# EAGLE design byteworker (EAGLE 6.5.0)

## Sheet 1 of 3: Connector
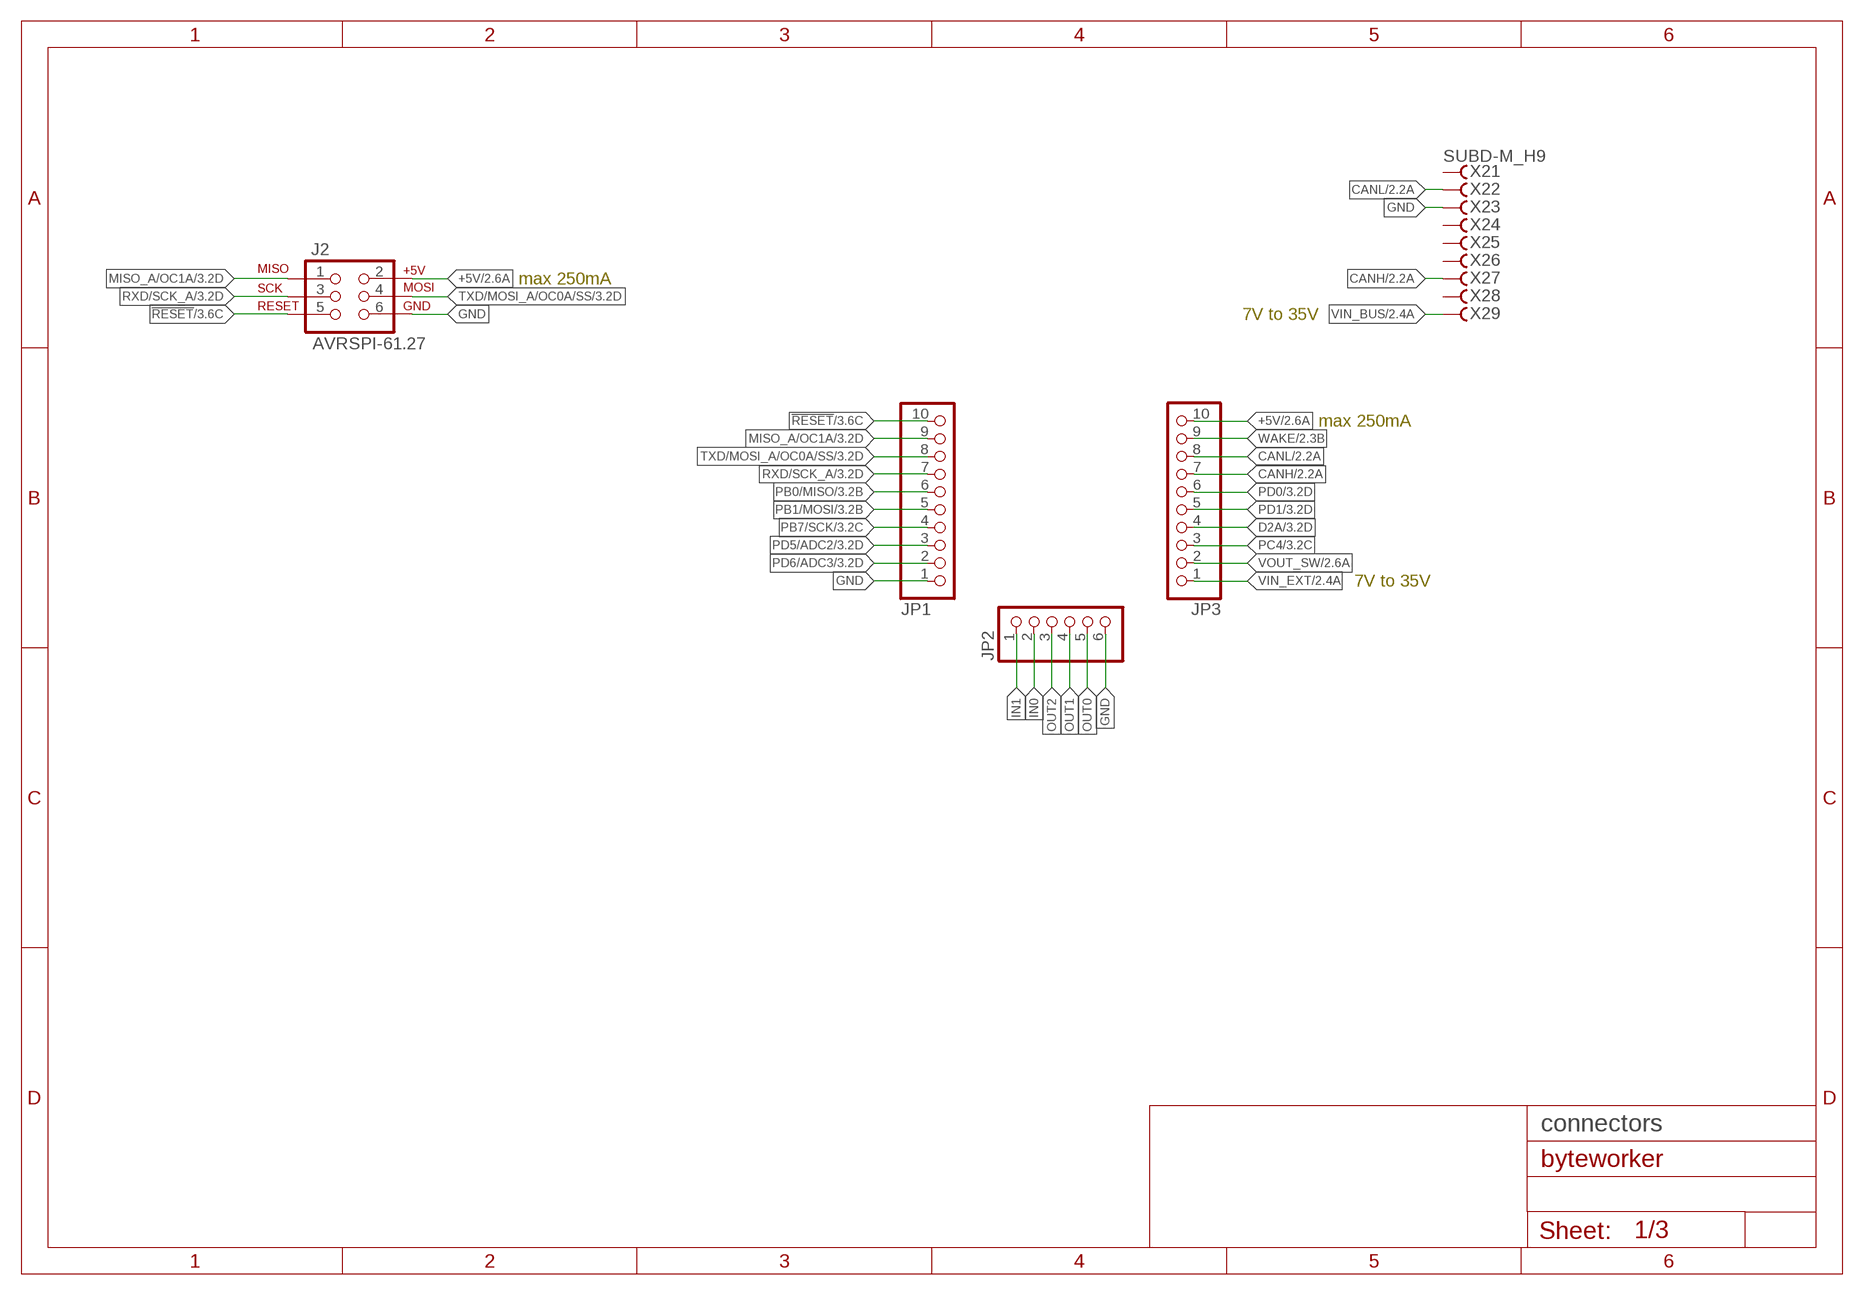
[diagram p0: schematic, sheet 1]

### Parts
J2  AVRSPI-61.27  [2X3-1.27]
JP1  PINHD-1X10  [1X10]
JP2  PINHD-1X6  [1X06]
JP3  PINHD-1X10  [1X10]
X2  SUBD-M_H9  [SUBD9]

### Nets
!RESET!: J2.5(RESET) JP1.10 ; also sheet 3
+5V: J2.2(+5V) JP3.10 ; also sheet 2,3
CANH: JP3.7 X2.8 ; also sheet 2
CANL: JP3.8 X2.4 ; also sheet 2
D2A: JP3.4 ; also sheet 3
GND: J2.6(GND) JP1.1 JP2.6 X2.3 ; also sheet 2,3
IN0: JP2.2 ; also sheet 3
IN1: JP2.1 ; also sheet 3
MISO_A/OC1A: J2.1(MISO) JP1.9 ; also sheet 3
OUT0: JP2.5 ; also sheet 3
OUT1: JP2.4 ; also sheet 3
OUT2: JP2.3 ; also sheet 3
PB0/MISO: JP1.6 ; also sheet 3
PB1/MOSI: JP1.5 ; also sheet 3
PB7/SCK: JP1.4 ; also sheet 3
PC4: JP3.3 ; also sheet 3
PD0: JP3.6 ; also sheet 3
PD1: JP3.5 ; also sheet 3
PD5/ADC2: JP1.3 ; also sheet 3
PD6/ADC3: JP1.2 ; also sheet 3
RXD/SCK_A: J2.3(SCK) JP1.7 ; also sheet 3
TXD/MOSI_A/OC0A/SS: J2.4(MOSI) JP1.8 ; also sheet 3
VIN_BUS: X2.6 ; also sheet 2
VIN_EXT: JP3.1 ; also sheet 2
VOUT_SW: JP3.2 ; also sheet 2
WAKE: JP3.9 ; also sheet 2
Unconnected: X2.1 X2.2 X2.5 X2.7 X2.9

### Notes on the sheet
- max 250mA
- 7V to 35V
- max 250mA
- 7V to 35V

## Sheet 2 of 3: Power & CAN
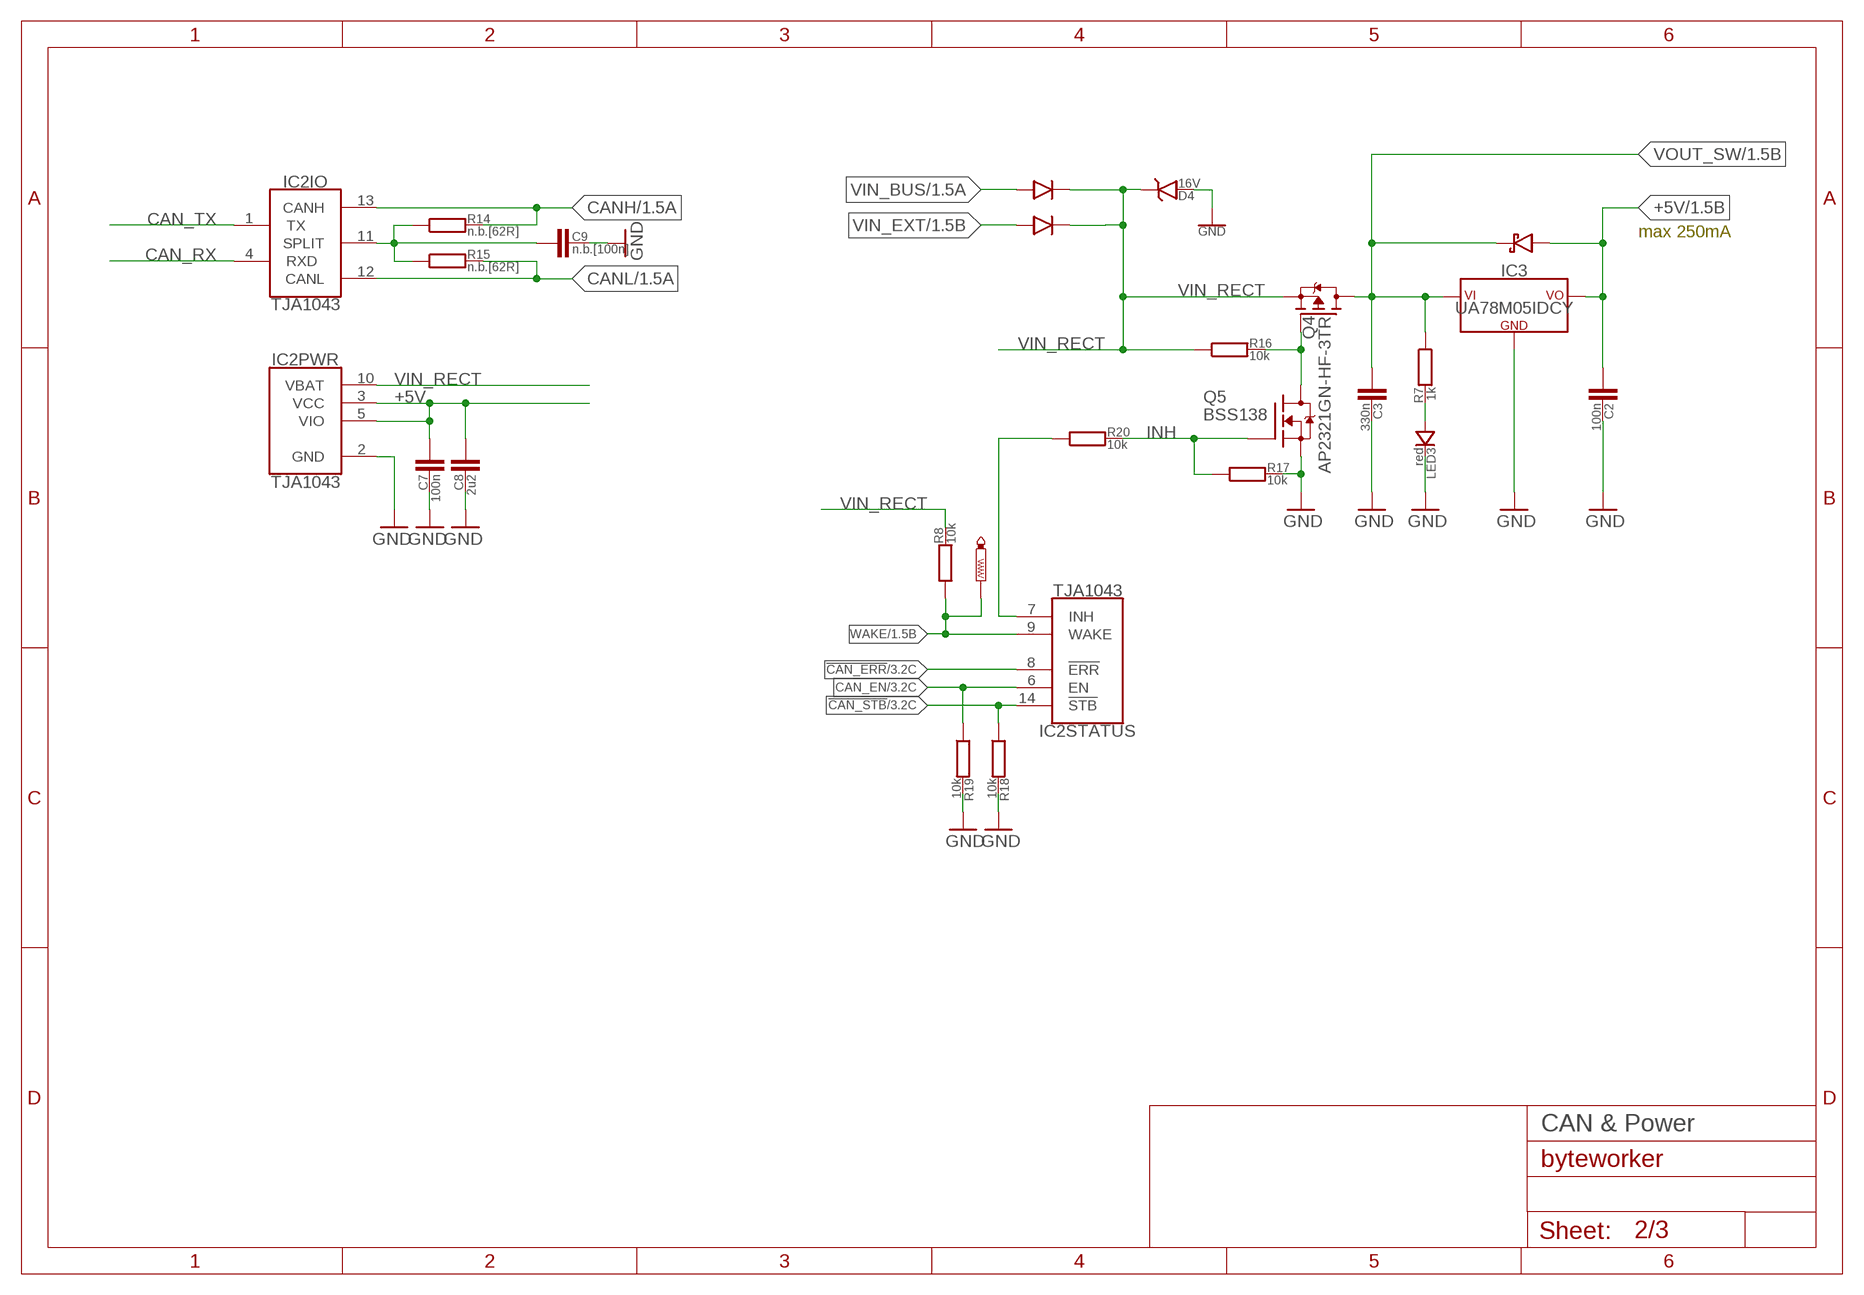
[diagram p1: schematic, sheet 2]

### Parts
C2  100n  C0603  [C0603]
C3  330n  C0603  [C0603]
C7  100n  C0603  [C0603]
C8  2u2  C0805  [C0805]
C9  n.b.[100n]  C0603  [C0603]
D1  1N5819HW  [SOD123]
D4  16V  ZENER_PTVS18VP1UP  [SOD-128]
D5  1N5819HW  [SOD123]
D6  SCHOTTKY323  [SOD323]
IC2  TJA1043  [SO14]
IC3  UA78M05IDCY  [SOT223]
LED3  red  LED0603  [LED0603]
Q4  AP2321GN-HF-3TR  [SOT23-3]
Q5  BSS138  [SOT23C]
R7  1k  R0603  [R0603]
R8  10k  R0603  [R0603]
R14  n.b.[62R]  R0603  [R0603]
R15  n.b.[62R]  R0603  [R0603]
R16  10k  R0603  [R0603]
R17  10k  R0603  [R0603]
R18  10k  R0603  [R0603]
R19  10k  R0603  [R0603]
R20  10k  R0603  [R0603]
TP2  PTR1B1,27  [B1,27]

### Nets
!CAN_ERR!: IC2.8(STATUS:!ERR!) ; also sheet 3
!CAN_STB!: IC2.14(STATUS:!STB!) R18.1 ; also sheet 3
+5V: C2.1 C7.1 C8.1 D6.A IC2.3(PWR:VCC) IC2.5(PWR:VIO) IC3.3(+5V) ; also sheet 1,3
CAN_EN: IC2.6(STATUS:EN) R19.1 ; also sheet 3
CAN_RX: IC2.4(IO:RXD) ; also sheet 3
CAN_TX: IC2.1(IO:TX) ; also sheet 3
CANH: IC2.13(IO:CANH) R14.2 ; also sheet 1
CANL: IC2.12(IO:CANL) R15.2 ; also sheet 1
GND: C2.2 C3.2 C7.2 C8.2 C9.2 D4.A IC2.2(PWR:GND) IC3.2(GND) IC3.4(GND) LED3.C Q5.2(S) R17.2 R18.2 R19.2 ; also sheet 1,3
INH: Q5.1(G) R17.1 R20.2
N$4: C9.1 IC2.11(IO:SPLIT) R14.1 R15.1
N$5: IC2.7(STATUS:INH) R20.1
N$6: Q4.1(G) Q5.3(D) R16.2
N$8: LED3.A R7.2
VIN_BUS: D5.A ; also sheet 1
VIN_EXT: D1.A ; also sheet 1
VIN_RECT: D1.C D4.C D5.C IC2.10(PWR:VBAT) Q4.2(S) R8.2 R16.1 ; also sheet 3
VOUT_SW: C3.1 D6.C IC3.1(VIN) Q4.3(D) R7.1 ; also sheet 1
WAKE: IC2.9(STATUS:WAKE) R8.1 TP2.TP ; also sheet 1

### Notes on the sheet
- max 250mA

## Sheet 3 of 3: uC
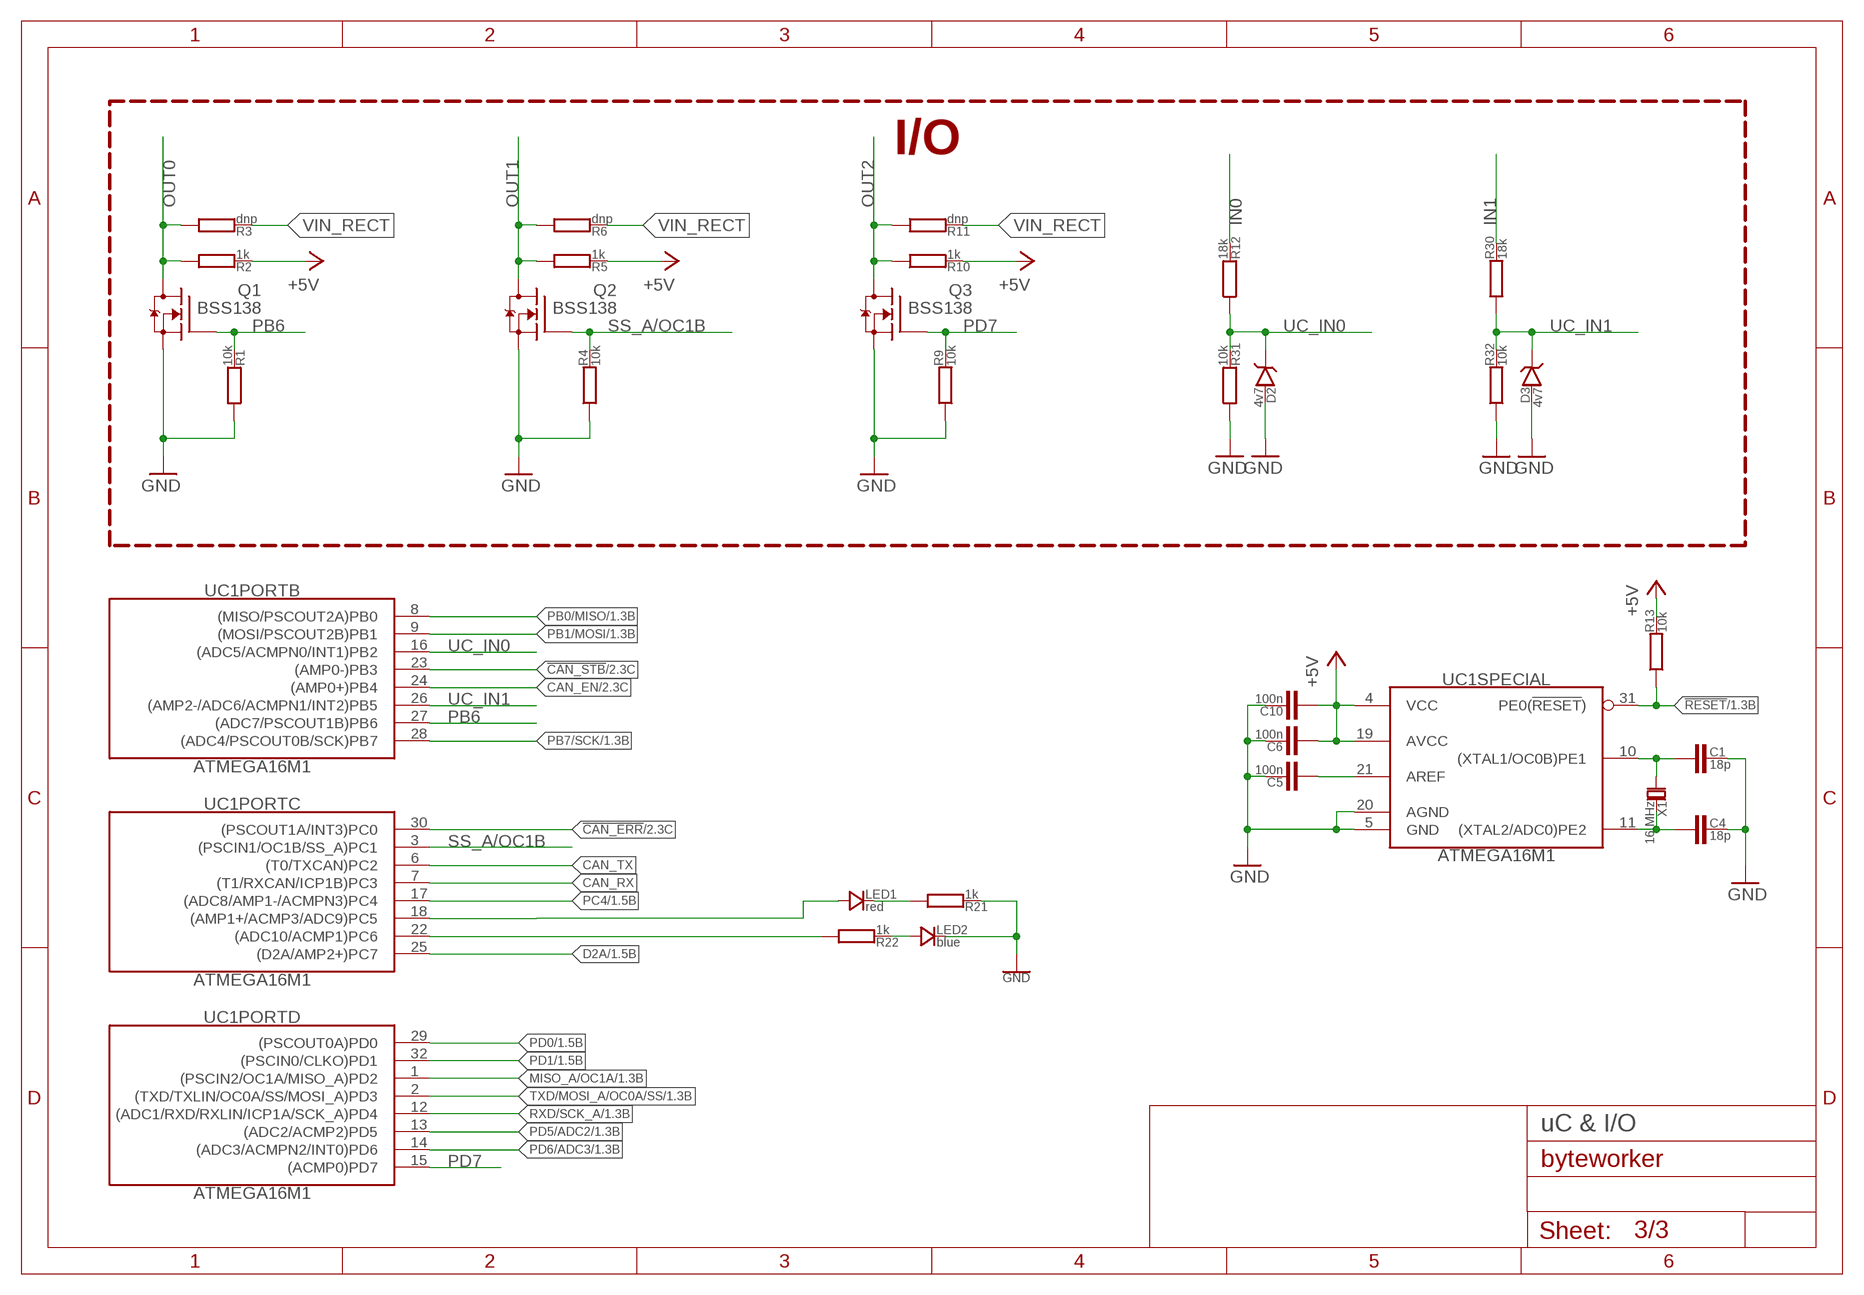
[diagram p2: schematic, sheet 3]

### Parts
C1  18p  C0603  [C0603]
C4  18p  C0603  [C0603]
C5  100n  C0603  [C0603]
C6  100n  C0603  [C0603]
C10  100n  C0603  [C0603]
D2  4v7  ZENER  [SOD80]
D3  4v7  ZENER  [SOD80]
LED1  red  LED0603  [LED0603]
LED2  blue  LED0603  [LED0603]
Q1  BSS138  [SOT23C]
Q2  BSS138  [SOT23C]
Q3  BSS138  [SOT23C]
R1  10k  R0603  [R0603]
R2  1k  R0603  [R0603]
R3  dnp  R0603  [R0603]
R4  10k  R0603  [R0603]
R5  1k  R0603  [R0603]
R6  dnp  R0603  [R0603]
R9  10k  R0603  [R0603]
R10  1k  R0603  [R0603]
R11  dnp  R0603  [R0603]
R12  18k  R0603  [R0603]
R13  10k  R0603  [R0603]
R21  1k  R0603  [R0603]
R22  1k  R0603  [R0603]
R30  18k  R0603  [R0603]
R31  10k  R0603  [R0603]
R32  10k  R0603  [R0603]
UC1  ATMEGA16M1  [TQFP32-08]
X1  16 MHz  CRYSTAL5X3.2  [5.0X3.2]

### Nets
!CAN_ERR!: UC1.30(PORTC:(PSCOUT1A/INT3)PC0) ; also sheet 2
!CAN_STB!: UC1.23(PORTB:(AMP0-)PB3) ; also sheet 2
!RESET!: R13.1 UC1.31(SPECIAL:PE0(!RESET!)) ; also sheet 1
+5V: C6.1 C10.1 R2.2 R5.2 R10.2 R13.2 UC1.4(SPECIAL:VCC) UC1.19(SPECIAL:AVCC) ; also sheet 1,2
AREF: C5.1 UC1.21(SPECIAL:AREF)
CAN_EN: UC1.24(PORTB:(AMP0+)PB4) ; also sheet 2
CAN_RX: UC1.7(PORTC:(T1/RXCAN/ICP1B)PC3) ; also sheet 2
CAN_TX: UC1.6(PORTC:(T0/TXCAN)PC2) ; also sheet 2
D2A: UC1.25(PORTC:(D2A/AMP2+)PC7) ; also sheet 1
GND: C1.2 C4.2 C5.2 C6.2 C10.2 D2.A D3.A LED2.C Q1.2(S) Q2.2(S) Q3.2(S) R1.1 R4.1 R9.1 R21.2 R31.1 R32.1 UC1.5(SPECIAL:GND) UC1.20(SPECIAL:AGND) ; also sheet 1,2
IN0: R12.2 ; also sheet 1
IN1: R30.2 ; also sheet 1
MISO_A/OC1A: UC1.1(PORTD:(PSCIN2/OC1A/MISO_A)PD2) ; also sheet 1
N$1: C1.1 UC1.10(SPECIAL:(XTAL1/OC0B)PE1) X1.1
N$2: C4.1 UC1.11(SPECIAL:(XTAL2/ADC0)PE2) X1.2
N$3: LED2.A R22.2
N$7: LED1.A UC1.18(PORTC:(AMP1+/ACMP3/ADC9)PC5)
N$9: LED1.C R21.1
OUT0: Q1.3(D) R2.1 R3.1 ; also sheet 1
OUT1: Q2.3(D) R5.1 R6.1 ; also sheet 1
OUT2: Q3.3(D) R10.1 R11.1 ; also sheet 1
PB0/MISO: UC1.8(PORTB:(MISO/PSCOUT2A)PB0) ; also sheet 1
PB1/MOSI: UC1.9(PORTB:(MOSI/PSCOUT2B)PB1) ; also sheet 1
PB6: Q1.1(G) R1.2 UC1.27(PORTB:(ADC7/PSCOUT1B)PB6)
PB7/SCK: UC1.28(PORTB:(ADC4/PSCOUT0B/SCK)PB7) ; also sheet 1
PC4: UC1.17(PORTC:(ADC8/AMP1-/ACMPN3)PC4) ; also sheet 1
PD0: UC1.29(PORTD:(PSCOUT0A)PD0) ; also sheet 1
PD1: UC1.32(PORTD:(PSCIN0/CLKO)PD1) ; also sheet 1
PD5/ADC2: UC1.13(PORTD:(ADC2/ACMP2)PD5) ; also sheet 1
PD6/ADC3: UC1.14(PORTD:(ADC3/ACMPN2/INT0)PD6) ; also sheet 1
PD7: Q3.1(G) R9.2 UC1.15(PORTD:(ACMP0)PD7)
RXD/SCK_A: UC1.12(PORTD:(ADC1/RXD/RXLIN/ICP1A/SCK_A)PD4) ; also sheet 1
SS_A/OC1B: Q2.1(G) R4.2 UC1.3(PORTC:(PSCIN1/OC1B/SS_A)PC1)
TESTLED2: R22.1 UC1.22(PORTC:(ADC10/ACMP1)PC6)
TXD/MOSI_A/OC0A/SS: UC1.2(PORTD:(TXD/TXLIN/OC0A/SS/MOSI_A)PD3) ; also sheet 1
UC_IN0: D2.C R12.1 R31.2 UC1.16(PORTB:(ADC5/ACMPN0/INT1)PB2)
UC_IN1: D3.C R30.1 R32.2 UC1.26(PORTB:(AMP2-/ADC6/ACMPN1/INT2)PB5)
VIN_RECT: R3.2 R6.2 R11.2 ; also sheet 2

### Notes on the sheet
- I/O

## Library data of the parts
C1-C10 = bytewerk-passive:C
D1 D5 = bytewerk-passive:1N5819HW: Si-Diode - Icont=1A
D2 D3 = bytewerk-passive:ZENER: zener diode
D4 = bytewerk-diode:ZENER: zener diode; MF: NXP; MPN: PTVS18VP1UP; OC_FARNELL: 1859877
D6 = bytewerk-passive:SCHOTTKY
IC2 = bytewerk-network:TJA1043: Highspeed CAN Tranceiver - split - inhibit; MF: NXP; MPN: TJA1043T,118; OC_MOUSER: 771-TJA1043T118
IC3 = bytewerk-vreg:UA78M05IDCY: Linear Regulator -Vmax=35V -Imax=500mA; MF: TEXAS INSTRUMENTS; MPN: UA78M05IDCY; OC_FARNELL: 1494947
J2 = bytewerk-con:AVRSPI-6: 6-PIN AVR ISP Connector
JP1 JP3 = pinhead:PINHD-1X10: PIN HEADER
JP2 = pinhead:PINHD-1X6: PIN HEADER
LED1-LED3 = bytewerk-led:LED0603
Q1-Q3 Q5 = bytewerk-fet:BSS138: n-channel mosfet Vds=50V Vgs=+/- 20V Amax=0.22A; MF: Fairchild Semiconductor; MPN: BSS138; OC_MOUSER: 512-BSS138
Q4 = bytewerk-transistor:AP2321GN-HF-3TR: P-Kanal Mosfet - Vds=40V - Vgs=+-20V - Imax=3.1A; MF: ADVANCED POWER ELECTRONICS CORP; MPN: AP2321GN-HF-3TR; OC_FARNELL: 2319601
R1-R6 R9-R12 R30-R32 = bytewerk-rcl:R
R7 R8 R13-R22 = bytewerk-passive:R
TP2 = testpad:PTR1: TEST PIN
UC1 = bytewerk-uc:ATMEGA16M1: 8-Bit Microcontroller - 1x ADC - 1x CAN 2.0 A/B with 6 Message Objects - 1x LIN 2.1 and UART - 1x SPI - 1x 8-Bit Timer - 1x 16-Bit Timer - debugWIRE - Power Stage Controller
X1 = bytewerk-crystal:CRYSTAL
X2 = bytewerk-con:SUBD

## Board
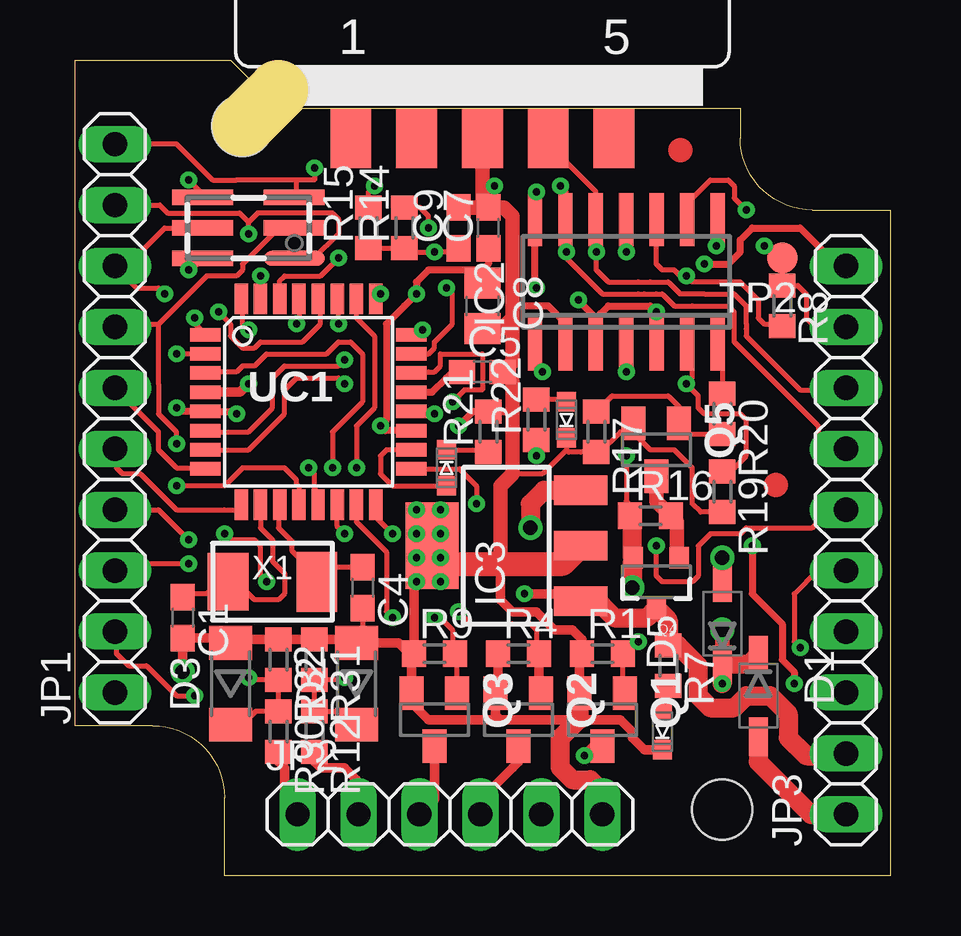
[diagram p3: board, top side]
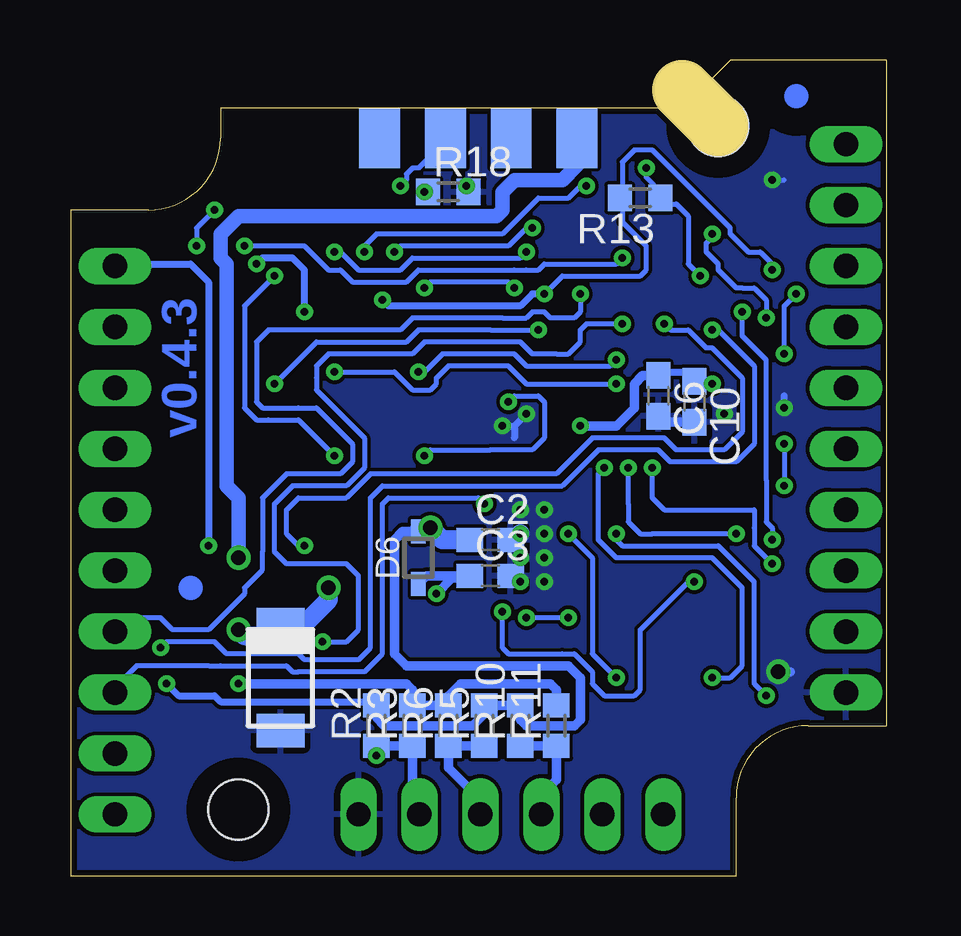
[diagram p4: board, bottom side, seen from below]

Size 34 x 34 mm. Coordinates in mm from the lower left corner, seen from the top.
Outline: 0,34 0,6.25 3.25,6.25 arc-90 6.25,3.25 6.25,0 34,0 34,27.75 30.75,27.75 arc-90 27.75,30.75 27.75,32 9.5,32 7.75,30.25 6,32 7.25,33.25 6.5,34 0,34
Copper layers (1*16): Top 0.035mm / dielectric 1.5mm / GND 0.035mm
Design rules "pro-2layer-cheap": minimum track width 0.15mm, minimum drill 0.3mm, track to track 0.15mm, track to pad 0.15mm, pad to pad 0.15mm, via to via 0.15mm, smd to smd 0mil, copper to edge 0.25mm, drill to drill 0.5mm, minimum pad ring 10mil, minimum via ring 8mil, stop-mask expansion 4mil, vias tented up to drill 0.3mm, thermal gap 10mil
Holes 2.5 mm at 7,31.25 27,2.75
tRestrict: area 25,0.8 to 29,4.8; area 5,29.2 to 9,33.2
bRestrict: area 25,0.8 to 29,4.8; area 5,29.2 to 9,33.2
Milling: 1 lines

### Footprints (pad centres in the part's own frame; a part is rotated, then mirrored left to right if it is on the bottom)
C0603 = smd 1.1 x 1: 1 -0.85,0; 2 0.85,0
C0805 = smd 1.3 x 1.5: 1 -0.95,0; 2 0.95,0
SOD123 = smd 1.6 x 0.8: A 1.7,0; C -1.7,0
SOD80 = smd 1.4 x 1.8: A 1.7,0; C -1.7,0
SOD-128 = smd 2 x 1.4: A 0,-2.2; C 0,2.2
SOD323 = smd 1 x 0.6: A 1.1,0; C -1.1,0
SO14 = smd 0.6 x 2.2: 1 -3.81,-2.6; 2 -2.54,-2.6; 3 -1.27,-2.6; 4 0,-2.6; 5 1.27,-2.6; 6 2.54,-2.6; 7 3.81,-2.6; 8 3.81,2.6; 9 2.54,2.6; 10 1.27,2.6; 11 0,2.6; 12 -1.27,2.6; 13 -2.54,2.6; 14 -3.81,2.6
SOT223 = smd 1.219 x 2.235: 1 -2.311,-3.099; 2 0,-3.099; 3 2.311,-3.099 | smd 3.6 x 2.2: 4 0,3.099
2X3-1.27 = smd 0.635 x 2.54: 1 -1.27,-1.905; 2 -1.27,1.905; 3 0,-1.905; 4 0,1.905; 5 1.27,-1.905; 6 1.27,1.905
1X10 = drill 1.016 long: 1 -11.43,0; 2 -8.89,0; 3 -6.35,0; 4 -3.81,0; 5 -1.27,0; 6 1.27,0; 7 3.81,0; 8 6.35,0; 9 8.89,0; 10 11.43,0
1X06 = drill 1.016 long: 1 -6.35,0; 2 -3.81,0; 3 -1.27,0; 4 1.27,0; 5 3.81,0; 6 6.35,0
LED0603 = smd 0.8 x 0.8: A -0.75,0; C 0.75,0
SOT23C = smd 1 x 1.4: 1 -0.95,-1.1; 2 0.95,-1.1; 3 0,1.1
SOT23-3 = smd 0.8 x 0.9: 1 -0.95,-1; 2 0.95,-1; 3 0,1.1
R0603 = smd 1 x 1.1: 1 -0.85,0; 2 0.85,0
B1,27 = smd 1.27 x 1.27: TP 0,0
TQFP32-08 = smd 1.27 x 0.559: 1 -4.293,2.8; 2 -4.293,2; 3 -4.293,1.2; 4 -4.293,0.4; 5 -4.293,-0.4; 6 -4.293,-1.2; 7 -4.293,-2; 8 -4.293,-2.8; 17 4.293,-2.8; 18 4.293,-2; 19 4.293,-1.2; 20 4.293,-0.4; 21 4.293,0.4; 22 4.293,1.2; 23 4.293,2; 24 4.293,2.8 | smd 0.559 x 1.27: 9 -2.8,-4.293; 10 -2,-4.293; 11 -1.2,-4.293; 12 -0.4,-4.293; 13 0.4,-4.293; 14 1.2,-4.293; 15 2,-4.293; 16 2.8,-4.293; 25 2.8,4.293; 26 2,4.293; 27 1.2,4.293; 28 0.4,4.293; 29 -0.4,4.293; 30 -1.2,4.293; 31 -2,4.293; 32 -2.8,4.293
5.0X3.2 = smd 1.7 x 2.4: 1 -1.85,0 | smd 1.7 x 2.5: 2 1.85,0
SUBD9 = smd 1.7 x 2.5: 1 -5.486,-5.5; 2 -2.743,-5.5; 3 0,-5.5; 4 2.743,-5.5; 5 5.486,-5.5 | smd 1.7 x 2.5 bottom: 6 -4.115,-5.5; 7 -1.372,-5.5; 8 1.372,-5.5; 9 4.115,-5.5

### Placement (x,y rotation side)
C1  4.5,10.75 270 top
C2  16.5,14 0 bottom
C3  16.5,12.5 0 bottom
C4  12,12 270 top
C5  17,21 0 top
C6  9.5,20 270 bottom
C7  17.25,27 90 top
C8  17,23.75 270 top
C9  16,27 90 top
C10  8,19.75 270 bottom
D1  28.5,7.5 270 top
D2  11.75,8 90 top
D3  6.5,8 90 top
D4  25.25,8.25 0 bottom
D5  27,10.5 90 top
D6  19.5,13.25 90 bottom
IC2  23,24.75 0 top
IC3  18,13.75 90 top
J2  7.25,27 90 top
JP1  1.68,19.06 90 top
JP2  15.64,2.55 0 top
JP3  32.16,13.98 90 top
LED1  15.5,17 90 top
LED2  20.5,19 270 top
LED3  24.5,6 270 top
Q1  22,6.5 180 top
Q2  18.5,6.5 180 top
Q3  15,6.5 180 top
Q4  24.25,12.25 180 top
Q5  24.25,17.75 180 top
R1  22,9.25 0 top
R2  21.25,6.25 90 bottom
R3  19.75,6.25 90 bottom
R4  18.5,9.25 0 top
R5  16.75,6.25 90 bottom
R6  18.25,6.25 90 bottom
R7  24.75,8.75 270 top
R8  29.5,23.75 270 top
R9  15,9.25 0 top
R10  15.25,6.25 90 bottom
R11  13.75,6.25 90 bottom
R12  10,6 270 top
R13  10.25,28.25 180 bottom
R14  13.75,27 90 top
R15  12.25,27 90 top
R16  24,15 0 top
R17  21.75,18.5 270 top
R18  18.25,28.5 0 bottom
R19  27,16 270 top
R20  27,19.25 270 top
R21  17.25,18.5 90 top
R22  19.25,19 90 top
R30  8.5,6 270 top
R31  10,9 270 top
R32  8.5,9 270 top
TP2  29.5,25.75 180 top
U$2  [FIDUCIAL_R]  29.23,16.29 0 top
U$4  [FIDUCIAL_R]  29,12 0 bottom
U$5  [FIDUCIAL_R]  25.25,30.25 0 top
U$6  [FIDUCIAL_R]  3.75,32.5 0 bottom
UC1  9.75,19.75 0 top
X1  8.25,12.25 0 top
X2  17,36.25 0 top

### Tracks (layer width: path | path; a pad name or v marks a point on that pad's centre or on a via)
!CAN_ERR!  (via drill 0.3)
  Top 0.2: IC2.8 26.81,26.31 v26.75,26.25 | UC1.30 8.55,24.8 8.75,25 10.25,25 v11,25.75
  GND 0.2: v26.75,26.25 26.25,26.25 24.25,26.25 23.25,25.25 22.75,25.25 22.25,24.75 20,24.75 19.5,25.25 15.5,25.25 15,25.25 14.5,25.25 14.25,25.5 11.25,25.5 v11,25.75
!CAN_STB!  (via drill 0.3)
  Top 0.15: IC2.14 19.19,28.44 v19.25,28.5
  Top 0.2: UC1.23 14.75,21.75 15,22 15,22.25 15.25,22.5 15.75,23 15.75,24.25 v15.5,24.5
  Top 0.3: v19.25,24.5 19.19,24.56 IC2.14
  GND 0.15: v19.25,28.5 R18.1
  GND 0.2: v19.25,24.5 19,24.75 15.75,24.75 v15.5,24.5
!RESET!  (via drill 0.3)
  Top 0.2: UC1.31 v7.75,25 | JP1.10 4.25,30.5 5.75,29 6.75,29 7.75,29 8,29 9.25,29 | 9.25,29 10,29 v10,29.5 | J2.5 9.25,28.37 9.25,29
  GND 0.2: v10,29.5 10,29.1 9.4,28.5 R13.1 9.15,28 8.75,28 8.25,27.5 8.25,25.5 v7.75,25
+5V  (via drill 0.3, 0.6)
  Top 0.2: J2.2 4.87,25.25 v4.75,25.25
  Top 0.3: 24.27,22.98 24.25,23 24.27,23.02 | 21.75,22.25 21.73,22.23 IC2.3 21.73,23.23 | 17,25.25 15.5,25.25 15.25,25.25 14.75,25.25 14.25,24.75 v14.25,24.25 13.75,23.75 13,23 13,19 v12.75,18.75 12.95,18.55 UC1.19 | v28.25,13.75 28.25,11.75 29.5,10.5 29.5,9 30,8.5 v30,8 | 24.25,22.13 IC2.5 24.27,23.02 | 21.73,23.23 22.25,23.75 24,23.75 v24.25,23.5 24.27,23.48 24.27,23.02 | v26.25,25.5 27.25,25.5 27.75,26 27.75,26.5 28.25,27 30.25,27 31.84,25.41 JP3.10 | C7.1 17.25,25.5 17,25.25 | v21,24 21,23.96 21.73,23.23 | 17,25.25 C8.1
  Top 0.4: UC1.4 6.9,20.15 v7.25,20.5
  Top 0.8: IC3.3 19.56,16.06 19,15.5 v19,14.5
  GND 0.2: v14.25,24.25 14,24.5 13.5,25 10.25,25 10,25.25 10,26.25 11,27.25 11,28.25 | v4.75,25.25 4.75,25.5 5.25,26 5.75,26 6.5,26.75 6.5,27 9.75,30.25 10.5,30.25 11,29.75 11,28.25 | R13.2 11,28.25 | 18.75,14.25 v19,14.5
  GND 0.3: JP3.10 32.06,25.5 29,25.5 28.25,24.75 v28.25,13.75 | R2.2 21.4,7.25 27.75,7.25 28,7.5 29.5,7.5 v30,8 | v24.25,23.5 24.25,25.25 24.75,25.75 26,25.75 v26.25,25.5 | v14.25,24.25 14.75,24.25 15.25,23.75 16,23.75 16.5,23.75 18.5,23.75 19,23.75 20.75,23.75 | 20.75,23.75 v21,24 20.75,23.75 | 9.25,21 8.4,21 C10.1
  GND 0.4: R2.2 21.25,6.6 20.9,6.25 17.25,6.25 16.75,6.75 R5.2 R10.2 15.25,6.5 15,6.25 13,6.25 12.75,6.5 12.75,8.25 13.25,8.75 16.25,8.75 17.75,8.75 20,8.75 20.5,9.25 20.5,11.25 20.5,14 20.15,14.35 D6.A | v12.75,18.75 11.25,18.75 10.5,19.5 10.5,20.5 10.15,20.85 C6.1 9.4,20.85 9.25,21 | C10.1 7.35,20.6 v7.25,20.5
  GND 0.8: D6.A 19.15,14.35 v19,14.5 | C2.1 18.5,14 18.75,14.25
AREF
  Top 0.3: UC1.21 14.9,20.15 15.5,20.75 15.75,21 C5.1
CAN_EN  (via drill 0.3)
  Top 0.2: R19.1 27.15,17 27.5,17 28,17.5 28,18.75 28,19 27.75,19.25 26.25,19.25 26,19.5 26,20 v25.5,20.5 25.75,20.75 25.75,21.94 IC2.6 25.5,22.19 | UC1.24 14.3,22.55 v14.5,22.75
  GND 0.2: v25.5,20.5 23.75,22.25 20,22.25 19.75,22.5 19.5,22.75 18.5,22.75 18,22.75 17,22.75 16.5,22.75 v14.5,22.75
CAN_RX  (via drill 0.3)
  Top 0.2: UC1.7 7.25,17.75 8.75,19.25 8.75,20.25 9.25,20.75 11,20.75 v11.25,20.5 | IC2.4 v23,21
  GND 0.2: v23,21 20.5,21 19.75,20.25 19,20.25 18.75,20.5 18.75,20.75 18.5,21 18.25,21.25 17.75,21.25 17.5,21.25 17.25,21.25 15.75,21.25 15,20.5 v11.25,20.5
CAN_TX  (via drill 0.3)
  Top 0.2: UC1.6 5.51,18.5 7.25,18.5 8.25,19.5 8.25,20.75 8.75,21.25 11,21.25 v11.25,21.5 | IC2.1 19.19,21.31 v19.5,21
  GND 0.2: v19.5,21 19.25,21 18.5,21.75 18,21.75 17.5,21.75 17,21.75 15.5,21.75 15,21.25 11.5,21.25 v11.25,21.5
CANH  (via drill 0.3)
  Top 0.15: IC2.13 20.5,27.39
  Top 0.2: IC2.13 20.5,27.31 v20.5,26 20.5,25.75 20.75,25.5 22,24.25 23.5,24.25 23.75,24.25 24.25,24.25 24.5,24.25 25,23.75 25.75,23.75 27.25,23.75 27.5,23.5 27.5,22.25 31,18.75 31,18.25 31.5,17.75 32.12,17.75 JP3.7 | R14.2 13.72,27.85 | R14.2 13.65,27.85 | v14.75,27 14.75,27.5 14.4,27.85 R14.2 | 20.5,27.39 20.5,28.5 v20.25,28.75
  GND 0.2: v20.5,26 20.25,26.25 16,26.25 15.75,26.25 15.5,26.5 15,27 v14.75,27 | X2.8 18.37,30.63 18.5,30.5 19.25,29.75 19.5,29.5 19.75,29.5 20,29.25 20,29 v20.25,28.75
CANL  (via drill 0.3)
  Top 0.15: 20,30.75 X2.4
  Top 0.2: R15.2 12.25,28.1 12.25,28.5 v12.5,28.75 | JP3.8 32.08,20.25 30.25,20.25 28.75,21.75 28,22.5 28,22.79 28,23.02 28,23.75 27.5,24.25 26.25,24.25 25.25,24.25 24.75,24.75 24,24.75 23.5,24.75 22.25,24.75 21.75,25.25 v21.75,26 21.75,27.33 IC2.12 21.73,28.52 20,30.25 19.74,30.51 X2.4
  GND 0.2: v21.75,26 21.75,26.25 21.25,26.75 16,26.75 15.25,27.5 14.5,28.25 13.25,28.25 12.75,28.75 v12.5,28.75
D2A  (via drill 0.3)
  Top 0.2: v12.75,24.25 v12.76,24.25 UC1.25
  GND 0.2: JP3.4 32.08,10.25 32,10.25 31.5,10.75 30.25,10.75 29.75,10.25 28.25,10.25 27,11.5 26.75,11.75 26.75,12 26,12.75 26,13.5 26,15.75 25,16.75 22.75,16.75 22.25,17.25 22.25,18 23.25,19 23.75,19.5 24.5,19.5 26,19.5 26.25,19.75 26.25,22.25 25.75,22.75 23.75,22.75 20.25,22.75 20,23 19.75,23.25 18.75,23.25 18.25,23.25 16.75,23.25 16.25,23.25 16,23.25 15,23.25 14.75,23.5 14.25,23.5 14,23.25 13,23.25 12.75,23.5 v12.75,24.25
GND  (via drill 0.3, 0.6)
  Top 0.2: C8.2 17.55,22.8 | R19.2 26.1,15.15 25.75,15.5 25.75,17 25,17.75 24,17.75 23.5,18.25 23.5,18.65 Q5.2 | 23.3,18.7 Q5.2 | D2.A 11.6,9.85 D2.A | C4.2 12,9.95 D2.A | J2.6 5.35,28.41 v4.75,29 | C1.2 4.6,9.9 4.75,9.75 | 21.9,17.65 22.75,18.5 22.95,18.5 Q5.2 | R17.2 21.1,17.65 20.6,17.65 20.5,17.75 | LED2.C 20.5,17.75 | 20.5,17.75 19.75,17 19.5,16.75 18.5,16.75 18.25,16.75 | 18.15,19.35 18.25,19.25
  Top 0.3: UC1.5 5.57,19.35 | 5.57,19.35 6.65,19.35 v6.75,19.25 | 17.6,27.85 C7.2 | UC1.20 14.9,19.35 v15,19.25 | Q5.2 23.2,18.75 23,18.75 | R17.2 21.9,17.65 | 5.57,19.35 4.4,19.35 v4.25,19.5 | IC2.2 20.46,23.04 20,23.5 19.75,23.75 18.75,23.75 18.25,23.75 | 18.15,19.35 R21.2 16.6,19.35 v16,18.75
  Top 0.4: Q1.2 21.05,9.15 R1.1 21.15,9.85 20.75,10.25 20,10.25 19.25,11 18.25,11 17.75,11.5 17.75,13 | 17.75,6.5 17.55,6.7 Q2.2 17.65,7.7 R4.1 | 17.75,6.5 14.75,6.5 14.05,7.2 Q3.2 14.05,9.15 13.5,9.7 D2.A | LED3.C 23.75,5.25 23.25,5.75 23.25,6 22.75,6.5 22.15,6.5 21.05,6.5 | 11.6,9.85 R31.1 R32.1 6.9,9.85 6.65,9.85 D3.A 6.3,9.9 6.05,9.9 C1.2 v4.5,8.5 | R9.1 14.15,12.15 v14.25,12.25 v14.25,13.25 | v14.25,15.25 v14.25,14.25 v14.25,13.25 | v14.25,13.25 14.4,13.25 IC3.4 15.25,14.1 v15.25,14.25 | 15.5,13 15.5,12.65 | 15.5,12.65 C3.2 15.5,12.65 | 15.65,12.85 v15.25,13.25 | 17.75,6.5 21,6.5
  Top 0.6: C8.2 17.8,22.8 18.12,23.12 | C9.2 C7.2 17,28.1 17,28.75 | 17.6,27.85 17.9,27.85 18.25,27.5 18.25,24 18.25,23.75 18.25,23.25 | 21,6.5 21.05,6.55 21.05,6.5 | 18.25,23.25 18.12,23.12 | 18,23 18.12,23.12 | 17,28.75 X2.3 | v17.5,28.75 17,28.75 | 18.25,23.25 18.25,21.4 C5.2 18.25,20.6 18.25,19.25 18.25,16.75 17.75,16.25 17.75,13
  Top 0.8: 14.05,9.15 R9.1 | 15.5,13 v15.25,13.25 14.9,13.6 IC3.4 | 21,6.5 20.25,5.75 20.25,4.5 20.75,4 21.5,4 22,3.51 JP2.6 | 21.05,6.5 Q1.2
  Top 1: 15.5,13 17.5,13 17.75,13 20.35,13 IC3.2
  GND 0.2: v4.75,29 4.25,29
  GND 0.3: v6.75,19.25 6.75,19 | v4.25,19.5 4.25,20 | v16,18.75 15.5,18.75 | 15.5,18.75 v15,19.25 | 15.5,18.75 15.5,18.25
  GND 0.4: v4.5,8.5 4,8.5 | C10.2 9.25,18.9 C6.2
  GND 0.6: R18.2 17.5,28.6 v17.5,28.75
  GND 0.8: C2.2 15.5,14 v15.25,14.25
  other vias: 15.25,15.25 15.25,12.25
  pour GND (isolate 0.15): 0.25,33.75 33.75,33.75 33.75,0.25 0.25,0.25
IN0
  Top 0.4: R12.2 10,4.75 10.25,4.5 11.25,4.5 11.75,4 11.75,2.63 JP2.2
IN1
  Top 0.4: R30.2 8.5,4.75 8.75,4.5 8.75,3.1 JP2.1
INH
  Top 0.2: R17.1 22.4,20 24.75,20 25.2,19.55 Q5.1 25.65,18.4 R20.2
MISO_A/OC1A  (via drill 0.3)
  Top 0.2: JP1.9 3.55,27.95 3.88,27.62 6.88,27.62 7,27.5 7.25,27.25 | 9.13,25.75 J2.1 9.98,25.73 11,26.75 11,27.38 10.75,27.62 7.62,27.62 7.25,27.25 | v7.25,26.75 7.25,27.25 | UC1.1 5,23.01 v5,23.25
  GND 0.2: 5,24 v5,23.25 5,24 | v7.25,26.75 7.25,26.62 7.5,26.38 7.5,26 7,25.5 7,25.25 6.25,24.5 6,24.5 5.5,24.5 5,24
N$1
  Top 0.2: C1.1 4.65,11.75 5.5,11.75 6,12.25 X1.1 6.75,12.25 7.5,11.5 8.5,11.5 8.75,11.75 8.75,12.6 8.25,13.1 8.25,14 7.75,14.5 UC1.10
N$2
  Top 0.2: C4.1 10.7,12.85 X1.2 10.1,12.5 9.05,13.55 9.05,13.95 8.5,14.5 8.5,15.41 UC1.11
N$3
  Top 0.2: LED2.A 20.4,19.85 R22.2
N$4  (via drill 0.3)
  Top 0.2: R15.1 R14.1 13.9,26 v15,26 15.85,26 C9.1 | IC2.11 v23,26
  GND 0.2: v23,26 22.75,26 22,25.25 20.25,25.25 19.75,25.75 15.25,25.75 v15,26
N$5
  Top 0.2: R20.1 27,21.84 27,21.96 IC2.7
N$6
  Top 0.4: 25.1,13.45 25.2,13.35 Q4.1
  Top 0.6: 25.1,13.45 25.1,14.75 R16.2 24.25,15.6 Q5.3
N$7
  Top 0.2: UC1.18 13,17.75 12.75,17.5 12.75,16.75 13.25,16.25 LED1.A
N$8
  Top 0.2: LED3.A 24.75,7 R7.2
N$9
  Top 0.2: LED1.C 17.15,17.75 R21.1
OUT0  (via drill 0.3)
  Top 0.4: v21.25,5 21.65,5.4 Q1.3
  GND 0.4: JP2.5 19.75,2.85 R3.1 R2.1 v21.25,5
OUT1
  Top 0.4: JP2.4 16.91,3.16 18.25,4.5 18.5,4.75 Q2.3
  GND 0.4: JP2.4 16.91,3.16 18.25,4.5 R6.1 R5.1
OUT2
  Top 0.4: Q3.3 15,3.18 JP2.3
  GND 0.4: JP2.3 14.38,3.38 13.75,4 R11.1 R10.1
PB0/MISO
  Top 0.2: JP1.6 3,19 3.5,18.5 3.5,18.25 3.5,17.75 4.25,17 5.41,17 UC1.8
PB1/MOSI
  Top 0.2: JP1.5 1.75,17.71 1.75,17 2,16.75 2.75,16.75 4.25,15.25 6.25,15.25 6.74,15.25 UC1.9
PB6  (via drill 0.3)
  Top 0.2: v11,23 11,23.99 UC1.27 | v23.5,9.75 23.35,9.75 R1.2 22.85,7.7 Q1.1
  GND 0.2: v11,23 12.5,23 12.75,22.75 12.75,22.25 13.25,21.75 13.75,21.75 14.75,21.75 15.25,22.25 16.75,22.25 17.25,22.25 17.75,22.25 18.25,22.25 19.25,22.25 19.5,22 19.75,21.75 22.75,21.75 23.25,21.75 23.5,21.5 23.75,21.25 23.75,20.75 23.75,20.25 23,19.5 21.75,18.25 21.75,17 22.5,16.25 24.75,16.25 25.5,15.5 25.5,13.5 25,13 22.5,13 22,12.5 22,10.25 22.5,9.75 v23.5,9.75
PB7/SCK  (via drill 0.3)
  Top 0.2: UC1.28 10.15,23.85 10.25,23.75 10.25,23 9.5,22.25 7.75,22.25 7.5,22 7,22 6.5,22.5 6.5,23 v6,23.5 | JP1.4 3.5,15.25 v4.75,14
  GND 0.2: v6,23.5 6,22.5 5,21.5 5,16.5 5,14.75 4.75,14.5 v4.75,14
PC4  (via drill 0.3)
  Top 0.2: UC1.17 16.05,16.95 16.75,16.25 v16.75,15.5
  GND 0.2: v16.75,15.5 17,15.75 20.75,15.75 21,15.5 21,9.25 21.75,8.5 24.5,8.5 24.75,8.5 25,8.75 27.75,8.75 28.25,8.75 28.5,8.75 29,8.75 31.25,8.75 31.5,8.5 31.75,8.25 32.16,7.85 JP3.3
PD0  (via drill 0.3)
  Top 0.2: JP3.6 31.66,14.75 31,14.75 30.75,14.5 28,14.5 27.75,14.25 26.5,14.25 26,13.75 26,12.5 25.75,12.25 24.5,12.25 24.25,12.5 v24.25,13.75 | UC1.29 9.35,23.1 v9.25,23
  GND 0.2: v9.25,23 9,22.75 8.25,22.75 8,22.5 7.5,22 7.25,22 6,20.75 6,18.5 6.75,17.75 8.75,17.75 9.25,18.25 12.25,18.25 13.75,16.75 21.5,16.75 22.5,15.75 24.5,15.75 25,15.25 25,14.25 24.5,13.75 v24.25,13.75
PD1  (via drill 0.3)
  Top 0.2: v7.25,22.75 7,23 7,23.99 UC1.32 | JP3.5 30.96,12.71 30,11.75 30,9.75 v30.25,9.5
  GND 0.2: v7.25,22.75 7,22.75 6,21.75 5.5,21.25 5.5,18 6.25,17.25 9,17.25 9.5,17.75 12,17.75 12.25,17.5 13.5,16.25 21,16.25 21.5,15.75 21.5,9.5 22,9 24.25,9 24.5,9.25 27.5,9.25 28,9.75 30,9.75 v30.25,9.5 | 32.16,12.66 JP3.5
PD5/ADC2  (via drill 0.3)
  Top 0.2: v9.75,17 10,16.75 10,16.11 10.15,15.96 UC1.13 | JP1.3 1.71,12.75 2.75,12.75 3,13 v4.75,13
  GND 0.2: v9.75,17 9.75,15.75 9.25,15.25 5.5,15.25 5.5,14.5 5.5,13.75 v4.75,13
PD6/ADC3  (via drill 0.3)
  Top 0.2: JP1.2 1.75,10.09 1.75,9.25 2.25,8.75 3,8.75 3.5,8.25 4.25,7.5 v5,7.5 | v11.25,14.25 11,14.5 10.95,14.55 UC1.14
  GND 0.2: v11.25,14.25 11.25,14 11,13.75 7,13.75 5.5,12.25 5.5,8 v5,7.5
PD7  (via drill 0.3)
  Top 0.2: Q3.1 15.95,9.15 R9.2 15.85,9.5 15.75,9.6 15.75,10.25 15.25,10.75 v15,10.75 | v13.25,10.75 13,11 13,13.5 12.75,13.75 12.25,14.25 11.75,14.75 UC1.15
  GND 0.2: v13.25,10.75 v15,10.75
RXD/SCK_A  (via drill 0.3)
  Top 0.2: v4.25,18 4.25,18.5 3.5,19.25 3.5,20.5 3.5,20.75 3.5,23 | J2.3 8.5,27 7,25.5 7,25.25 6.75,25 5.5,25 5.25,24.75 4.5,24 3.75,23.25 3.5,23 | UC1.12 9.35,16.21 9.25,16.31 9.25,16.5 8.75,17 7,17 6.25,16.25 v4.25,16.25 | JP1.7 1.8,23 3.5,23
  GND 0.2: v4.25,18 v4.25,16.25
SS_A/OC1B  (via drill 0.3)
  Top 0.2: v10.75,17 10.75,18.5 12,19.75 12,21.75 11.5,22.25 11,22.25 10.5,21.75 8,21.75 7.5,21.25 7,21.25 6.75,21 6,21 5.95,20.95 UC1.3 | v8,12.25 7.75,12.5 7.75,13.75 7.5,14 6.5,14 v6.25,14.25 | v16,11 16.5,10.5 18.25,10.5 19,10.5 19.25,10.25 19.25,9.6 19.35,9.5 R4.2
  Top 0.4: Q2.1 19.35,7.7 R4.2
  GND 0.2: v6.25,14.25 9.75,14.25 10.25,14.25 10.75,14.75 10.75,15.5 v10.75,17 | v8,12.25 8.25,12.25 10.25,10.25 10.25,7.75 10.5,7.5 11.75,7.5 12.25,8 12.25,8.5 13,9.25 13.5,9.25 15.75,9.25 16,9.5 v16,11
TESTLED2  (via drill 0.3)
  Top 0.2: UC1.22 14.09,21 14.75,21 15,21 15.25,21.25 15.25,21.5 15.25,21.75 17,21.75 17,20.25 16.25,20.25 16,20 v15.75,19.75 | R22.1 v19.25,17.5
  GND 0.2: v19.25,17.5 19,17.75 16.5,17.75 14.75,17.75 14.25,18.25 14.25,19.75 14.5,20 15.5,20 v15.75,19.75
TXD/MOSI_A/OC0A/SS  (via drill 0.3)
  Top 0.2: UC1.2 v4.25,21.75 | JP1.8 2.09,25.41 | 2.09,25.41 2.16,25.41 3.75,27 J2.4 | JP1.8 2.09,25.41 | JP1.8 2.59,24.5 3.5,24.5 v3.75,24.25
  GND 0.2: v4.25,21.75 4.25,23.25 4.25,23.75 v3.75,24.25
UC_IN0  (via drill 0.3)
  Top 0.2: v13.25,14.25 13.05,14.45 12.55,14.95 UC1.16 | D2.C 11.2,6.85 R12.1 R31.2 11.1,8.15 11.2,8.25 v11.25,8.25
  GND 0.2: v13.25,14.25 12.25,13.25 12.25,9.25 v11.25,8.25
UC_IN1  (via drill 0.3)
  Top 0.2: UC1.26 11.75,23.25 12.5,22.5 12.5,19.5 11.75,18.75 v11.75,17 | D3.C 6.75,6.05 7.55,6.85 R30.1 R32.2 7.35,8.15 v7.25,8.25
  GND 0.2: v7.25,8.25 6.5,8.25 6,8.75 6,12 7.25,13.25 11.25,13.25 12,14 12,16.75 v11.75,17
VIN_BUS  (via drill 0.6)
  Top 0.6: v27,13.25 D5.A
  GND 0.6: v27,13.25 27,15.75 27.5,16.25 27.5,25.5 27.75,25.75 27.75,26.75 27.5,27 27,27.5 16.25,27.5 16,27.75 16,28.5 15.5,29 14.5,29 13.5,29 12.88,29.62 X2.6
VIN_EXT
  Top 0.8: D1.A 28.5,4.75 30.5,2.75 30.7,2.55 JP3.1
VIN_RECT  (via drill 0.3, 0.6)
  Top 0.2: 24.25,27.33 IC2.10 24.27,26.73 24.27,26.52 24.25,26.5 24.25,25.5 24.5,25.25 25,25.25 25.25,25 v25.5,25 25.75,24.75 27.75,24.75 28.5,24 28.5,23.25 28.75,23 29.4,23 R8.2 | v23,17.5 23,15.6 23.15,15.45 R16.1
  Top 0.6: v27,10.25 D5.C | 23.3,14.85 R16.1
  Top 0.8: v23.25,12 23.25,13.05 23.3,13.1 Q4.2 23.25,13.3 23.25,14.75 23.15,14.85 R16.1 | v27,8 D5.C 28.1,8.8 D1.C
  GND 0.2: v23,17.5 24.5,19 25.75,19 26.25,19 26.75,19.5 26.75,23.75 v25.5,25 | D4.C 25.25,10
  GND 0.4: R11.2 13.75,7.75 14,8 17.75,8 18.25,7.5 R6.2 R3.2 19.75,7.75 20,8 26.75,8 v27,8
  GND 0.8: v27,10.25 26.75,10 25.25,10 24.75,10 23.25,11.5 v23.25,12
VOUT_SW  (via drill 0.3)
  Top 0.4: v18.75,11.75 20.79,11.75 IC3.1
  Top 0.6: 25.15,9.6 R7.1
  Top 0.8: R7.1 24.75,10.65 Q4.3 23.85,10.75 22.5,10.75 22.25,11 21.81,11.44 IC3.1 | 25.15,9.6 26,8.75 26,7.5 26.5,7 27.5,7 28,7.5 29,7.5 29.75,6.75 29.75,5.75 30.41,5.09 30.5,5 31.25,5 31.34,5.09 JP3.2
  GND 0.4: D6.C 19.15,12.5 C3.1 17.35,12.4 18.1,12.4 v18.75,11.75
WAKE  (via drill 0.3)
  Top 0.2: IC2.9 25.54,28.04 26.5,29 27.25,29 27.5,28.75 27.5,28.25 v28,27.75 | JP3.9 32.02,23 30.75,23 30.5,23.25 30.5,24.25 30.15,24.6 R8.1 TP2.TP 29,26.25 v28.75,26.25
  GND 0.2: v28,27.75 28.75,27 v28.75,26.25

### Text on the board
GND: v0.4.3
bStop: v0.4.3